# Altium schematic sheet IMUAndSonar.SchDoc
size A4; SheetNumber: 7; SheetTotal: 8
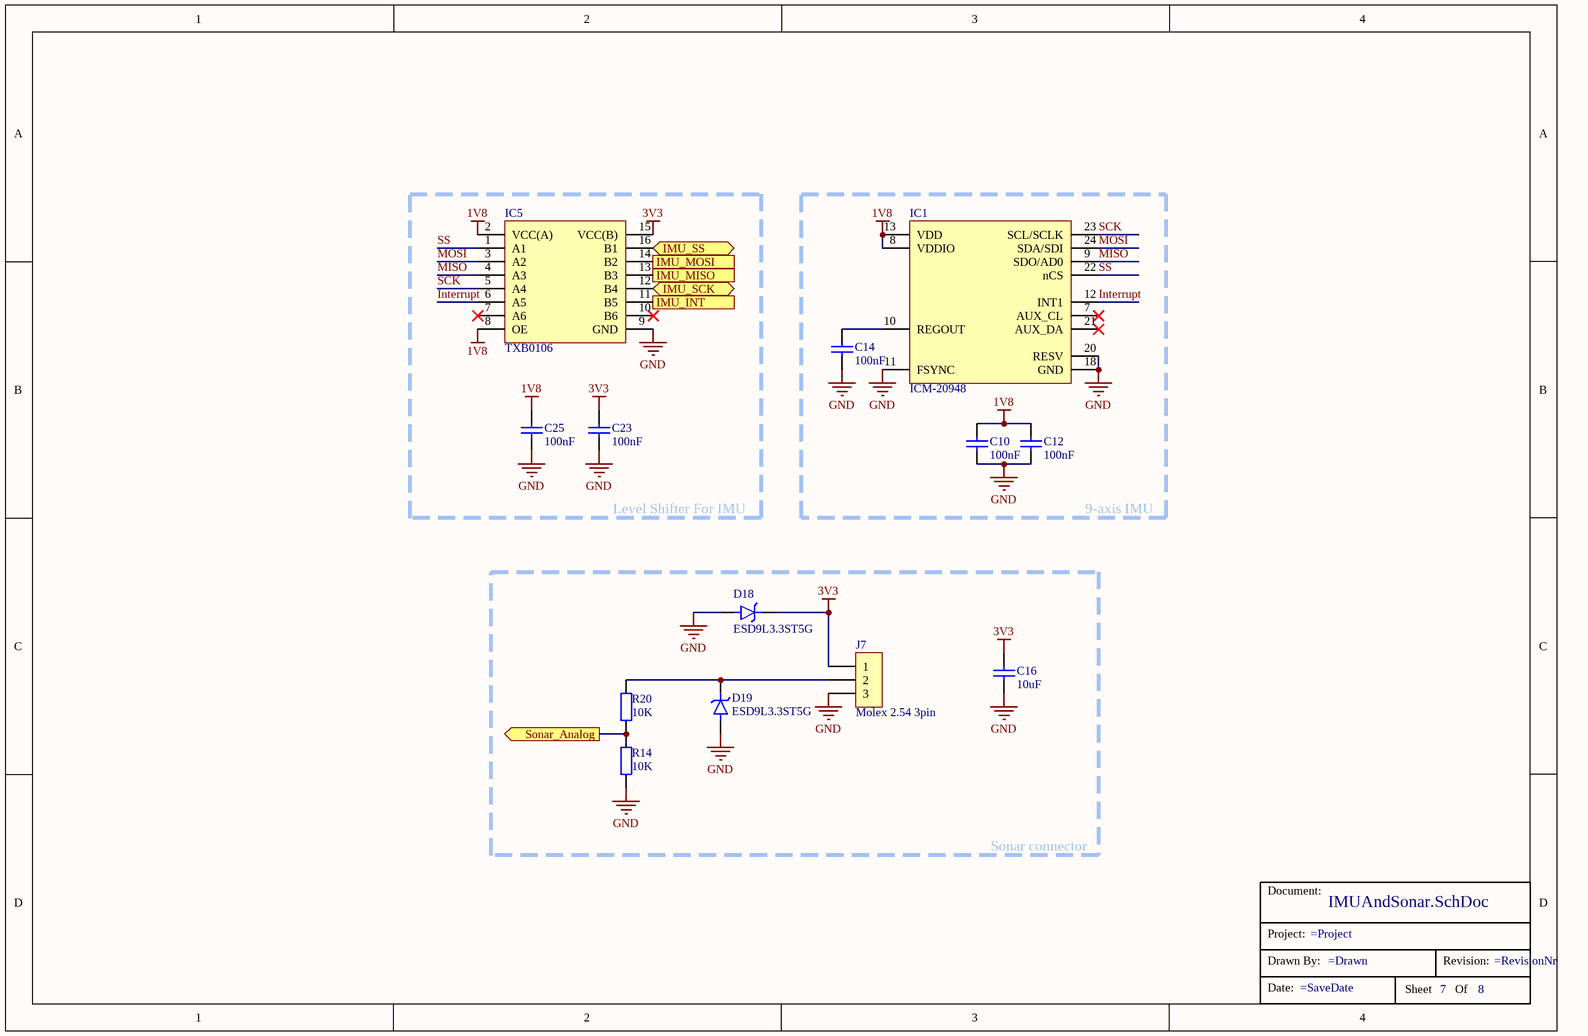
[diagram p0: IMUAndSonar.SchDoc]

## Parts
*  TitleBox  (value not drawn)
C10  Capacitance: 100nF  [C0603 N]
C12  Capacitance: 100nF  [C0603 N]
C14  Capacitance: 100nF  [C0603 N]
C16  Capacitance: 10uF  [C1206 N]
C23  Capacitance: 100nF  [C0603 N]
C25  Capacitance: 100nF  [C0603 N]
D18  ESD9L3.3ST5G  [SOD923F, NOMINAL]
D19  ESD9L3.3ST5G  [SOD923F, NOMINAL]
IC1  ICM-20948  [QFN-24, 3x3MM, NOMINAL]
IC5  TXB0106  [VQFN-16, 4x3.5MM, NOMINAL]
J7  Molex 2.54 3pin  [22-27-2031]
R14  10K  [R0603]
R20  10K  [R0603]

## Blocks framed on the sheet
Level Shifter For IMU: C23 C25 IC5
9-axis IMU: C10 C12 C14 IC1
Sonar connector: C16 D18 D19 J7 R14 R20

## Ports
IMU_INT (out), IMU_MISO (out), IMU_MOSI (in), IMU_SCK (bidir), IMU_SS (bidir), Sonar_Analog (out)

## Nets
1V8: C10.2 C12.2 C25.2 IC1.8(VDDIO) IC1.13(VDD) IC5.2(VCC(A)) IC5.8(OE)
3V3: C16.2 C23.2 D18.C IC5.15(VCC(B)) J7.1
GND: C10.1 C12.1 C14.1 C16.1 C23.1 C25.1 D18.A D19.A IC1.11(FSYNC) IC1.18(GND) IC1.20(RESV) IC5.9(GND) J7.3 R14.2
IMU_INT: IC5.11(B5) ; port IMU_INT
IMU_MISO: IC5.13(B3) ; port IMU_MISO
IMU_MOSI: IC5.14(B2) ; port IMU_MOSI
IMU_SCK: IC5.12(B4) ; port IMU_SCK
IMU_SS: IC5.16(B1) ; port IMU_SS
Interrupt: IC1.12(INT1) IC5.6(A5)
MISO: IC1.9(SDO/AD0) IC5.4(A3)
MOSI: IC1.24(SDA/SDI) IC5.3(A2)
SCK: IC1.23(SCL/SCLK) IC5.5(A4)
Sonar_Analog: R14.1 R20.2 ; port Sonar_Analog
SS: IC1.22(nCS) IC5.1(A1)
NetC14_2: C14.2 IC1.10(REGOUT)
NetD19_C: D19.C J7.2 R20.1

Not connected (* = marked no-connect by the designer): IC1 7(AUX_CL)* 21(AUX_DA)*; IC5 7(A6)* 10(B6)*

## Notes on the sheet
- (in symbol TitleBox) Document:; Project:; Drawn By:; Revision:; Date:; Sheet; Of

## Library data of the parts
C10 C12 C14 C16 C23 C25 = Capacitor: Ceramic capacitor; Type: MLCC; Voltage rating: *V; Characteristic: *; Manufacturer: *
  C10 C12 C14 C23 C25: Note: C0603 N
  C16: Note: C1206 N
D18 D19 = ESD9L3.3ST5G: TVS DIODE, Unidir, 3.3V/9V, 150mW, SOD-923, ESD9L3.3ST5G, ON SEMICONDUCTOR; Clamping Voltage: 9V; Reverse Standoff Voltage: 3.3V; Breakdown Voltage: 4.8V; Peak Pulse Current: 1A; Leakage Current: 1uA; Supplier 1: Farnell; Manufacturer: ON Semiconductor; Manufacturer Part Number: ESD9L3.3ST5G; Case/Package: SOD-923-2; Operating Temperature Range: -55 .. 125°C; Peak Pulse Power: 150mW; ComponentLink1URL: https://www.verical.com/server-webapp/html/getDatasheet?partID=148186&src-supplier=Verical; ComponentLink1Description: Datasheet; Supplier Part Number 1: 2533269
IC1 = ICM-20948: 9-axis IMU, SPI and I2C, 1.8Vin, 24QFN; ComponentLink1Description: Datasheet; ComponentLink1URL: https://www.invensense.com/wp-content/uploads/2016/06/DS-000189-ICM-20948-v1.3.pdf; Supplier 1: Farnell; Supplier Part Number 1: 2911498
IC5 = TXB0106: Level shifter, 6 inputs, 1.2 .. 5.5Vin, 4ns delay, TXB0106, TEXAS INSTRUMENTS; ComponentLink1Description: Datasheet; ComponentLink1URL: http://www.ti.com/lit/ds/symlink/txb0106.pdf; Supplier 1: Farnell; Supplier Part Number 1: 3120970
J7 = Molex header, 3 pin, KK 6410 series: Current Rating: 4A; Supplier 1: Farnell; Manufacturer Part Number: 22-27-2031; Product Range: KK 6410 Series; ComponentLink1URL: http://www.farnell.com/datasheets/1023435.pdf; ComponentLink1Description: Datasheet; ComponentLink2URL: http://www.farnell.com/cad/1595526.pdf; ComponentLink2Description: Drawing; Supplier 2: Mouser; Supplier 3: TME; Supplier Part Number 1: 9731156; Supplier Part Number 2: 538-22-27-2031; Supplier Part Number 3: MX-6410-03A
R14 R20 = Resistor: Precision: *%; Voltage rating: *V; Temp coefficient: *ppm; Power rating: *mW; Manufacturer: *; Resistance: 10K; Note: R0603